# EAGLE schematic atmega328_tlc5940 (2) (EAGLE 6.4)
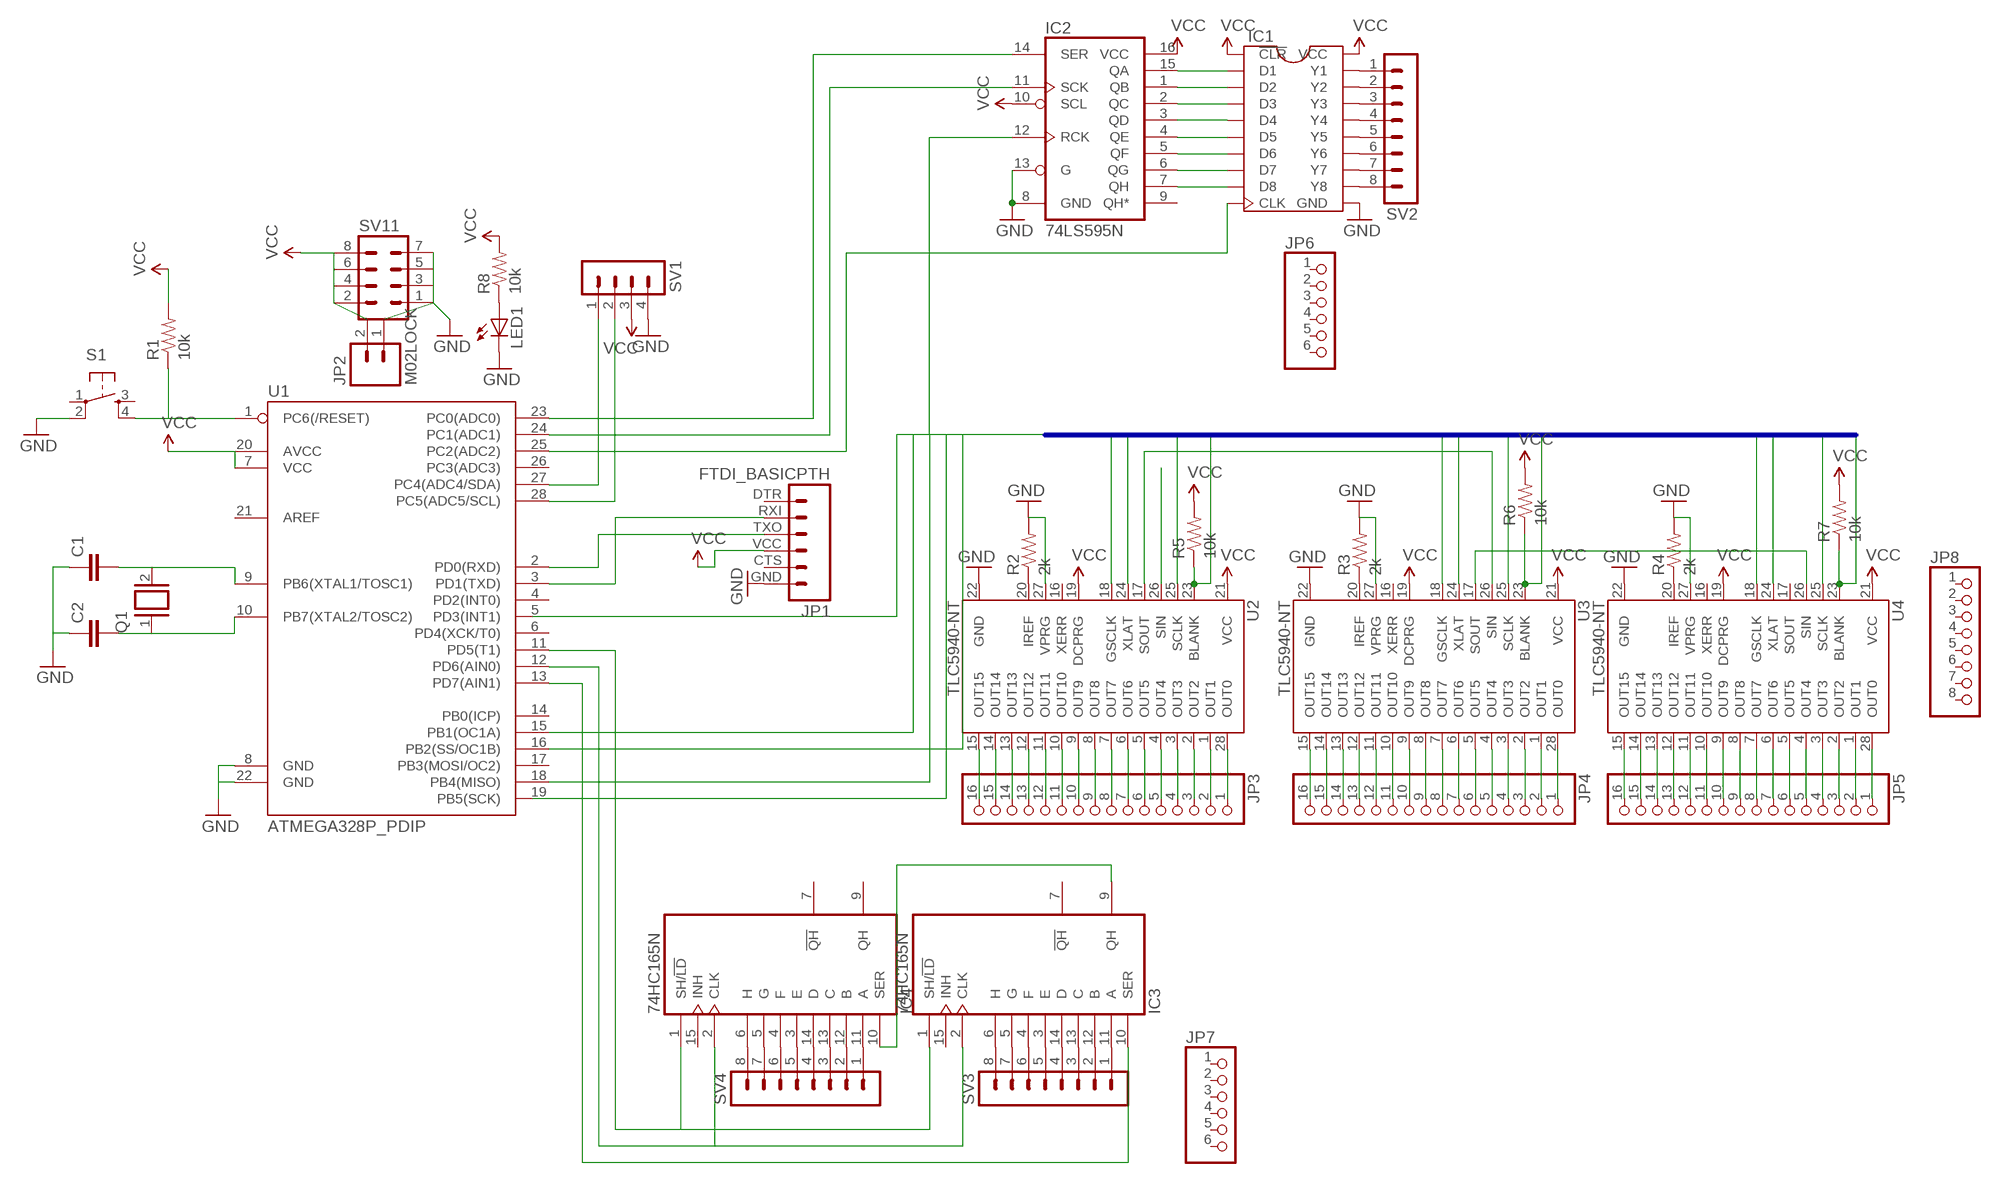
[diagram p0: schematic, sheet 1]

## Parts
C1  CAPEZ  [CAP-PTH-SMALLEZ]
C2  CAPEZ  [CAP-PTH-SMALLEZ]
IC1  IC-PACKAGE_DIL20S  [IC-PACKAGE_SOCKET-20]
IC2  74LS595N  [DIL16]
IC3  74HC165N  [DIL16]
IC4  74HC165N  [DIL16]
JP1  FTDI_BASICPTH  [FTDI_BASIC]
JP2  M02LOCK  [1X02_LOCK]
JP3  PINHD-1X16  [1X16]
JP4  PINHD-1X16  [1X16]
JP5  PINHD-1X16  [1X16]
JP6  PINHD-1X6  [1X06]
JP7  PINHD-1X6  [1X06]
JP8  PINHD-1X8  [1X08]
LED1  LED5MM  [LED5MM]
Q1  XTAL/S  [QS]
R1  10k  RESISTORKIT  [AXIAL-0.3-KIT]
R2  2k  RESISTORKIT  [AXIAL-0.3-KIT]
R3  2k  RESISTORKIT  [AXIAL-0.3-KIT]
R4  2k  RESISTORKIT  [AXIAL-0.3-KIT]
R5  10k  RESISTORKIT  [AXIAL-0.3-KIT]
R6  10k  RESISTORKIT  [AXIAL-0.3-KIT]
R7  10k  RESISTORKIT  [AXIAL-0.3-KIT]
R8  10k  RESISTORKIT  [AXIAL-0.3-KIT]
S1  TAC_SWITCHPTH  [TACTILE-PTH]
SV1  MA04-1  [MA04-1]
SV2  MA08-1  [MA08-1]
SV3  MA08-1  [MA08-1]
SV4  MA08-1  [MA08-1]
SV11  MA04-2  [MA04-2]
U1  ATMEGA328P_PDIP  [DIL28-3]
U2  TLC5940-NT  [DIL28-3]
U3  TLC5940-NT  [DIL28-3]
U4  TLC5940-NT  [DIL28-3]

## Nets
GND: C1.1 C2.1 IC1.11(GND) IC2.8(GND) IC2.13(G) JP1.GND JP2.1 LED1.K(C) R2.P$2 R3.P$2 R4.P$2 S1.2 SV1.4 SV11.1 SV11.3 SV11.5 SV11.7 U1.8(GND) U1.22(GND) U2.22(GND) U2.27(VPRG) U3.22(GND) U3.27(VPRG) U4.22(GND) U4.27(VPRG)
N$1: R1.P$1 S1.4 U1.1(PC6(/RESET))
N$2: C1.2 Q1.2 U1.9(PB6(XTAL1/TOSC1))
N$3: C2.2 Q1.1 U1.10(PB7(XTAL2/TOSC2))
N$4: JP3.16 U2.15(OUT15)
N$5: JP3.15 U2.14(OUT14)
N$6: JP3.14 U2.13(OUT13)
N$7: JP3.13 U2.12(OUT12)
N$8: JP3.12 U2.11(OUT11)
N$9: JP3.11 U2.10(OUT10)
N$10: JP3.10 U2.9(OUT9)
N$11: JP3.9 U2.8(OUT8)
N$12: JP3.8 U2.7(OUT7)
N$13: JP3.7 U2.6(OUT6)
N$14: JP3.6 U2.5(OUT5)
N$15: JP3.5 U2.4(OUT4)
N$16: JP3.4 U2.3(OUT3)
N$17: JP3.3 U2.2(OUT2)
N$18: JP3.2 U2.1(OUT1)
N$19: JP3.1 U2.28(OUT0)
N$20: JP4.16 U3.15(OUT15)
N$21: JP4.15 U3.14(OUT14)
N$22: JP4.14 U3.13(OUT13)
N$23: SV1.1 U1.27(PC4(ADC4/SDA))
N$24: JP4.13 U3.12(OUT12)
N$25: JP4.12 U3.11(OUT11)
N$26: JP4.11 U3.10(OUT10)
N$27: JP4.10 U3.9(OUT9)
N$28: JP4.9 U3.8(OUT8)
N$29: JP4.8 U3.7(OUT7)
N$30: JP4.7 U3.6(OUT6)
N$31: JP4.6 U3.5(OUT5)
N$32: JP4.5 U3.4(OUT4)
N$33: JP4.4 U3.3(OUT3)
N$34: JP4.3 U3.2(OUT2)
N$35: JP4.2 U3.1(OUT1)
N$36: JP4.1 U3.28(OUT0)
N$37: JP5.1 U4.28(OUT0)
N$38: JP5.2 U4.1(OUT1)
N$39: JP5.3 U4.2(OUT2)
N$40: JP5.4 U4.3(OUT3)
N$41: JP5.5 U4.4(OUT4)
N$42: JP5.6 U4.5(OUT5)
N$43: JP5.7 U4.6(OUT6)
N$44: JP5.8 U4.7(OUT7)
N$45: JP5.9 U4.8(OUT8)
N$46: JP5.10 U4.9(OUT9)
N$47: JP5.11 U4.10(OUT10)
N$48: JP5.12 U4.11(OUT11)
N$49: JP5.13 U4.12(OUT12)
N$50: JP5.14 U4.13(OUT13)
N$51: JP5.15 U4.14(OUT14)
N$52: JP5.16 U4.15(OUT15)
N$53: R2.P$1 U2.20(IREF)
N$54: R3.P$1 U3.20(IREF)
N$55: R4.P$1 U4.20(IREF)
N$56: LED1.A R8.P$1
N$57: SV1.2 U1.28(PC5(ADC5/SCL))
N$58: IC1.2(D1) IC2.15(QA)
N$59: U2.26(SIN)
N$60: U2.17(SOUT) U3.26(SIN)
N$61: U3.17(SOUT) U4.26(SIN)
N$62: IC1.3(D2) IC2.1(QB)
N$63: IC1.4(D3) IC2.2(QC)
N$64: IC1.5(D4) IC2.3(QD)
N$65: IC1.6(D5) IC2.4(QE)
N$66: IC1.7(D6) IC2.5(QF)
N$67: IC1.8(D7) IC2.6(QG)
N$68: IC1.9(D8) IC2.7(QH)
N$69: IC2.14(SER) U1.23(PC0(ADC0))
N$70: IC2.11(SCK) U1.24(PC1(ADC1))
N$71: IC1.10(CLK) U1.25(PC2(ADC2))
N$72: IC1.19(Y1) SV2.1
N$73: IC1.18(Y2) SV2.2
N$74: IC1.17(Y3) SV2.3
N$75: IC1.16(Y4) SV2.4
N$76: IC1.15(Y5) SV2.5
N$77: IC1.14(Y6) SV2.6
N$78: IC1.13(Y7) SV2.7
N$79: IC1.12(Y8) SV2.8
N$80: IC3.11(A) SV3.1
N$81: IC3.12(B) SV3.2
N$82: IC3.13(C) SV3.3
N$83: IC3.14(D) SV3.4
N$84: IC3.3(E) SV3.5
N$85: IC3.4(F) SV3.6
N$86: IC3.5(G) SV3.7
N$87: IC3.6(H) SV3.8
N$88: IC4.11(A) SV4.1
N$89: IC4.12(B) SV4.2
N$90: IC4.13(C) SV4.3
N$91: IC4.14(D) SV4.4
N$92: IC4.3(E) SV4.5
N$93: IC4.4(F) SV4.6
N$94: IC4.5(G) SV4.7
N$95: IC4.6(H) SV4.8
N$96: IC3.10(SER) U1.13(PD7(AIN1))
N$97: IC3.2(CLK) IC4.2(CLK) U1.12(PD6(AIN0))
N$98: IC3.9(QH) IC4.10(SER)
N$99: IC3.1(SH/!LD) IC4.1(SH/!LD) U1.11(PD5(T1))
RX$0: JP1.TXO U1.2(PD0(RXD))
SERIAL0: U1.18(PB4(MISO)) U2.18(GSCLK) U3.18(GSCLK) U4.18(GSCLK)
SERIAL1: IC2.12(RCK) U1.15(PB1(OC1A)) U2.24(XLAT) U3.24(XLAT) U4.24(XLAT)
SERIAL2: R5.P$1 R6.P$1 R7.P$1 U1.16(PB2(SS/OC1B)) U2.23(BLANK) U3.23(BLANK) U4.23(BLANK)
SERIAL3: U2.25(SCLK) U3.25(SCLK) U4.25(SCLK)
TX$0: JP1.RXI U1.3(PD1(TXD))
VCC: IC1.1(!CLR) IC1.20(VCC) IC2.10(SCL) IC2.16(VCC) JP1.VCC JP2.2 R1.P$2 R5.P$2 R6.P$2 R7.P$2 R8.P$2 SV1.3 SV11.2 SV11.4 SV11.6 SV11.8 U1.7(VCC) U1.20(AVCC) U2.19(DCPRG) U2.21(VCC) U3.19(DCPRG) U3.21(VCC) U4.19(DCPRG) U4.21(VCC)
Unconnected: IC2.9(QH*) IC3.7(!QH) IC3.15(INH) IC4.7(!QH) IC4.9(QH) IC4.15(INH) JP1.CTS JP1.DTR JP6.1 JP6.2 JP6.3 JP6.4 JP6.5 JP6.6 JP7.1 JP7.2 JP7.3 JP7.4 JP7.5 JP7.6 JP8.1 JP8.2 JP8.3 JP8.4 JP8.5 JP8.6 JP8.7 JP8.8 S1.1 S1.3 U1.4(PD2(INT0)) U1.5(PD3(INT1)) U1.6(PD4(XCK/T0)) U1.14(PB0(ICP)) U1.17(PB3(MOSI/OC2)) U1.19(PB5(SCK)) U1.21(AREF) U1.26(PC3(ADC3)) U2.16(XERR) U3.16(XERR) U4.16(XERR) U4.17(SOUT)

## Buses
SERIAL[0..5]

## Power pins joined to a net without a drawn wire
GND: IC3.8(GND) IC4.8(GND)
VCC: IC3.16(VCC) IC4.16(VCC)

## Library data of the parts
C1 C2 = SparkFun-Passives:CAP: Capacitor Standard 0603 ceramic capacitor, and 0.1" leaded capacitor.
IC1 = TLC59213:IC-PACKAGE_DIL20: Dual In Line / Socket
IC2 = SparkFun-DigitalIC:74*595: 8-bit SHIFT REGISTER, output latch
IC3 IC4 = 74xx-eu:74*165: 8-bit parallel load SHIFT REGISTER
JP1 = SparkFun-Connectors:FTDI_BASIC: FTDI Basic header with labels
JP2 = SparkFun-Connectors:M02: Standard 2-pin 0.1" header. Use with - straight break away headers ( PRT-00116) - right angle break away headers (PRT-00553) - swiss pins (PRT-00743) - machine pins (PRT-00117) - female headers (PRT-00115) Molex polarized connector foot print use with: PRT-08233 with associated crimp pins and housings. 2.54_SCREWTERM for use with PRT-10571. 3.5mm Screw Terminal footprints for PRT-08084 5mm Screw Terminal footprints for use with PRT-08433
JP3-JP5 = pinhead:PINHD-1X16: PIN HEADER
JP6 JP7 = pinhead:PINHD-1X6: PIN HEADER
JP8 = pinhead:PINHD-1X8: PIN HEADER
LED1 = led:LED: LED OSRAM: - CHIPLED LG R971, LG N971, LY N971, LG Q971, LY Q971, LO R971, LY R971 LH N974, LH R974 LS Q976, LO Q976, LY Q976 LO Q996 - Hyper CHIPLED LW Q18S LB Q993, LB Q99A, LB R99A - SideLED LS A670, LO A670, LY A670, LG A670, LP A670 LB A673, LV A673, LT A673, LW A673 LH A674 LY A675 LS A676, LA A676, LO A676, LY A676, LW A676 LS A679, LY A679, LG A679 - Hyper Micro SIDELED® LS Y876, LA Y876, LO Y876, LY Y876 LT Y87S - SmartLED LW L88C, LW L88S LB L89C, LB L89S, LG L890 LS L89K, LO L89K, LY L89K LS L896, LA L896, LO L896, LY L896 - TOPLED LS T670, LO T670, LY T670, LG T670, LP T670 LSG T670, LSP T670, LSY T670, LOP T670, LYG T670 LG T671, LOG T671, LSG T671 LB T673, LV T673, LT T673, LW T673 LH T674 LS T676, LA T676, LO T676, LY T676, LB T676, LH T676, LSB T676, LW T676 LB T67C, LV T67C, LT T67C, LS T67K, LO T67K, LY T67K, LW E67C LS E67B, LA E67B, LO E67B, LY E67B, LB E67C, LV E67C, LT E67C LW T67C LS T679, LY T679, LG T679 LS T770, LO T770, LY T770, LG T770, LP T770 LB T773, LV T773, LT T773, LW T773 LH T774 LS E675, LA E675, LY E675, LS T675 LS T776, LA T776, LO T776, LY T776, LB T776 LHGB T686 LT T68C, LB T68C - Hyper Mini TOPLED® LB M676 - Mini TOPLED Santana® LG M470 LS M47K, LO M47K, LY M47K Source: http://www.osram.convergy.de LUXEON: - LUMILED® LXK2-PW12-R00, LXK2-PW12-S00, LXK2-PW14-U00, LXK2-PW14-V00 LXK2-PM12-R00, LXK2-PM12-S00, LXK2-PM14-U00 LXK2-PE12-Q00, LXK2-PE12-R00, LXK2-PE12-S00, LXK2-PE14-T00, LXK2-PE14-U00 LXK2-PB12-K00, LXK2-PB12-L00, LXK2-PB12-M00, LXK2-PB14-N00, LXK2-PB14-P00, LXK2-PB14-Q00 LXK2-PR12-L00, LXK2-PR12-M00, LXK2-PR14-Q00, LXK2-PR14-R00 LXK2-PD12-Q00, LXK2-PD12-R00, LXK2-PD12-S00 LXK2-PH12-R00, LXK2-PH12-S00 LXK2-PL12-P00, LXK2-PL12-Q00, LXK2-PL12-R00 Source: www.luxeon.com KINGBRIGHT: KA-3528ASYC Source: www.kingbright.com
Q1 = special:XTAL/S: CRYSTAL
R1 R8 = SparkFun-Passives:RESISTOR: Resistor Basic schematic elements and footprints for 0603, 1206, and PTH resistors.
R2-R7 = SparkFun-Resistors:RESISTOR: Resistor Basic schematic elements and footprints for 0603, 1206, and PTH resistors.
S1 = SparkFun-Electromechanical:TAC_SWITCH: Momentary Switch Button commonly used for reset or general input. Spark Fun Electronics SKU : COM-00097 SMT- SWCH-08247
SV1 = con-lstb:MA04-1: PIN HEADER; OC_FARNELL: unknown; OC_NEWARK: unknown
SV2-SV4 = con-lstb:MA08-1: PIN HEADER; OC_FARNELL: unknown; OC_NEWARK: unknown
SV11 = con-lstb:MA04-2: PIN HEADER; OC_FARNELL: unknown; OC_NEWARK: unknown
U1 = SparkFun-DigitalIC:ATMEGA328P_PDIP: uC used in the Arduino 32kb flash, 1k EEPROM, 2k SRAM This is the through-hole version of this chip.
U2-U4 = SparkFun-DigitalIC:TLC5940: 16-channel LED Driver with Dot Correction and Grayscale PWM Control The TLC5940 is a 16-channel, constant-current sink LED driver. Each channel has an individually adjustable 4096-step grayscale PWM brightness control and a 64-step, constant-current sink (dot correction). The dot correction adjusts the brightness variations between LED channels and other LED drivers. The dot correction data is stored in an integrated EEPROM. Both grayscale control and dot correction are accessible via a serial interface. A single external resistor sets the maximum current value of all 16 channels. Packages: 28-pin HTSSOP 32-pin 5x5mm QFN 28-pin DIP